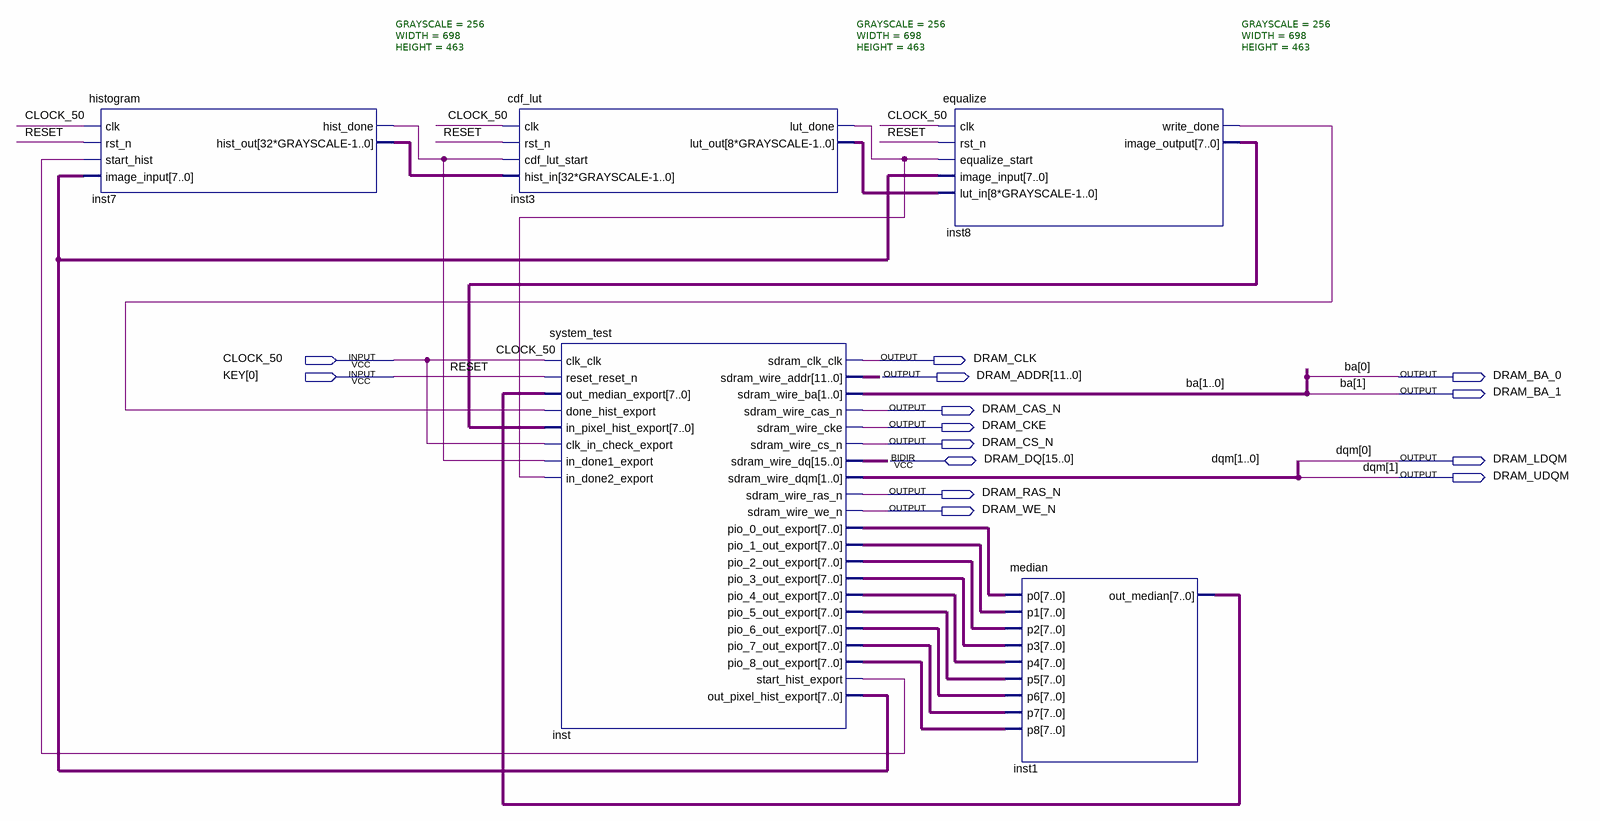
[diagram p0: schematic sheet]
// Quartus schematic test1.bdf as structural Verilog: 5 symbols, 14 pins
module test1 (
  input  CLOCK_50,
  input  [0:0] KEY,
  inout  [15:0] DRAM_DQ,
  output DRAM_CLK,
  output [11:0] DRAM_ADDR,
  output DRAM_BA_0,
  output DRAM_BA_1,
  output DRAM_CAS_N,
  output DRAM_CKE,
  output DRAM_CS_N,
  output DRAM_LDQM,
  output DRAM_UDQM,
  output DRAM_RAS_N,
  output DRAM_WE_N
);

  wire inst3_lut_done, inst7_hist_done, inst7_hist_out, inst8_write_done, inst_start_hist_export;
  wire [7:0] inst1_out_median, inst8_image_output, inst_out_pixel_hist_export, inst_pio_0_out_export,
       inst_pio_1_out_export, inst_pio_2_out_export, inst_pio_3_out_export, inst_pio_4_out_export,
       inst_pio_5_out_export, inst_pio_6_out_export, inst_pio_7_out_export, inst_pio_8_out_export;
  wire [2047:0] inst3_lut_out;

  histogram #(.GRAYSCALE(256), .WIDTH(698), .HEIGHT(463)) inst7 (
    .clk(CLOCK_50), .rst_n(KEY[0]), .start_hist(inst_start_hist_export),
    .image_input(inst_out_pixel_hist_export), .hist_done(inst7_hist_done), .hist_out(inst7_hist_out));
  cdf_lut #(.GRAYSCALE(256), .WIDTH(698), .HEIGHT(463)) inst3 (
    .clk(CLOCK_50), .rst_n(KEY[0]), .cdf_lut_start(inst7_hist_done), .hist_in(inst7_hist_out),
    .lut_done(inst3_lut_done), .lut_out(inst3_lut_out));
  system_test inst (
    .clk_clk(CLOCK_50), .reset_reset_n(KEY[0]), .out_median_export(inst1_out_median),
    .done_hist_export(inst8_write_done), .in_pixel_hist_export(inst8_image_output),
    .clk_in_check_export(CLOCK_50), .in_done1_export(inst7_hist_done), .in_done2_export(inst3_lut_done),
    .sdram_clk_clk(DRAM_CLK), .sdram_wire_addr(DRAM_ADDR), .sdram_wire_ba({DRAM_BA_1, DRAM_BA_0}),
    .sdram_wire_cas_n(DRAM_CAS_N), .sdram_wire_cke(DRAM_CKE), .sdram_wire_cs_n(DRAM_CS_N),
    .sdram_wire_dqm({DRAM_UDQM, DRAM_LDQM}), .sdram_wire_ras_n(DRAM_RAS_N), .sdram_wire_we_n(DRAM_WE_N),
    .pio_0_out_export(inst_pio_0_out_export), .pio_1_out_export(inst_pio_1_out_export),
    .pio_2_out_export(inst_pio_2_out_export), .pio_3_out_export(inst_pio_3_out_export),
    .pio_4_out_export(inst_pio_4_out_export), .pio_5_out_export(inst_pio_5_out_export),
    .pio_6_out_export(inst_pio_6_out_export), .pio_7_out_export(inst_pio_7_out_export),
    .pio_8_out_export(inst_pio_8_out_export), .start_hist_export(inst_start_hist_export),
    .out_pixel_hist_export(inst_out_pixel_hist_export), .sdram_wire_dq(DRAM_DQ));
  equalize #(.GRAYSCALE(256), .WIDTH(698), .HEIGHT(463)) inst8 (
    .clk(CLOCK_50), .rst_n(KEY[0]), .equalize_start(inst3_lut_done),
    .image_input(inst_out_pixel_hist_export), .lut_in(inst3_lut_out), .write_done(inst8_write_done),
    .image_output(inst8_image_output));
  median inst1 (
    .p0(inst_pio_0_out_export), .p1(inst_pio_1_out_export), .p2(inst_pio_2_out_export),
    .p3(inst_pio_3_out_export), .p4(inst_pio_4_out_export), .p5(inst_pio_5_out_export),
    .p6(inst_pio_6_out_export), .p7(inst_pio_7_out_export), .p8(inst_pio_8_out_export),
    .out_median(inst1_out_median));

  // Other names for the same wires on the sheet: ba[1:0] = {DRAM_BA_1, DRAM_BA_0}; dqm[1:0] = {DRAM_UDQM, DRAM_LDQM};
  //   RESET = KEY[0]
endmodule
